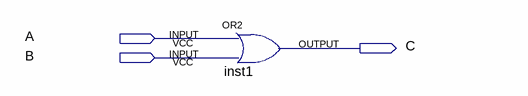
[diagram p0: schematic sheet]
// Quartus schematic eX1.bdf as structural Verilog: 1 symbols, 3 pins
module eX1 (
  input  A,
  input  B,
  output C
);

  or inst1 (C, A, B);
endmodule
